# EAGLE design MS_Gauge (EAGLE 7.1.0)
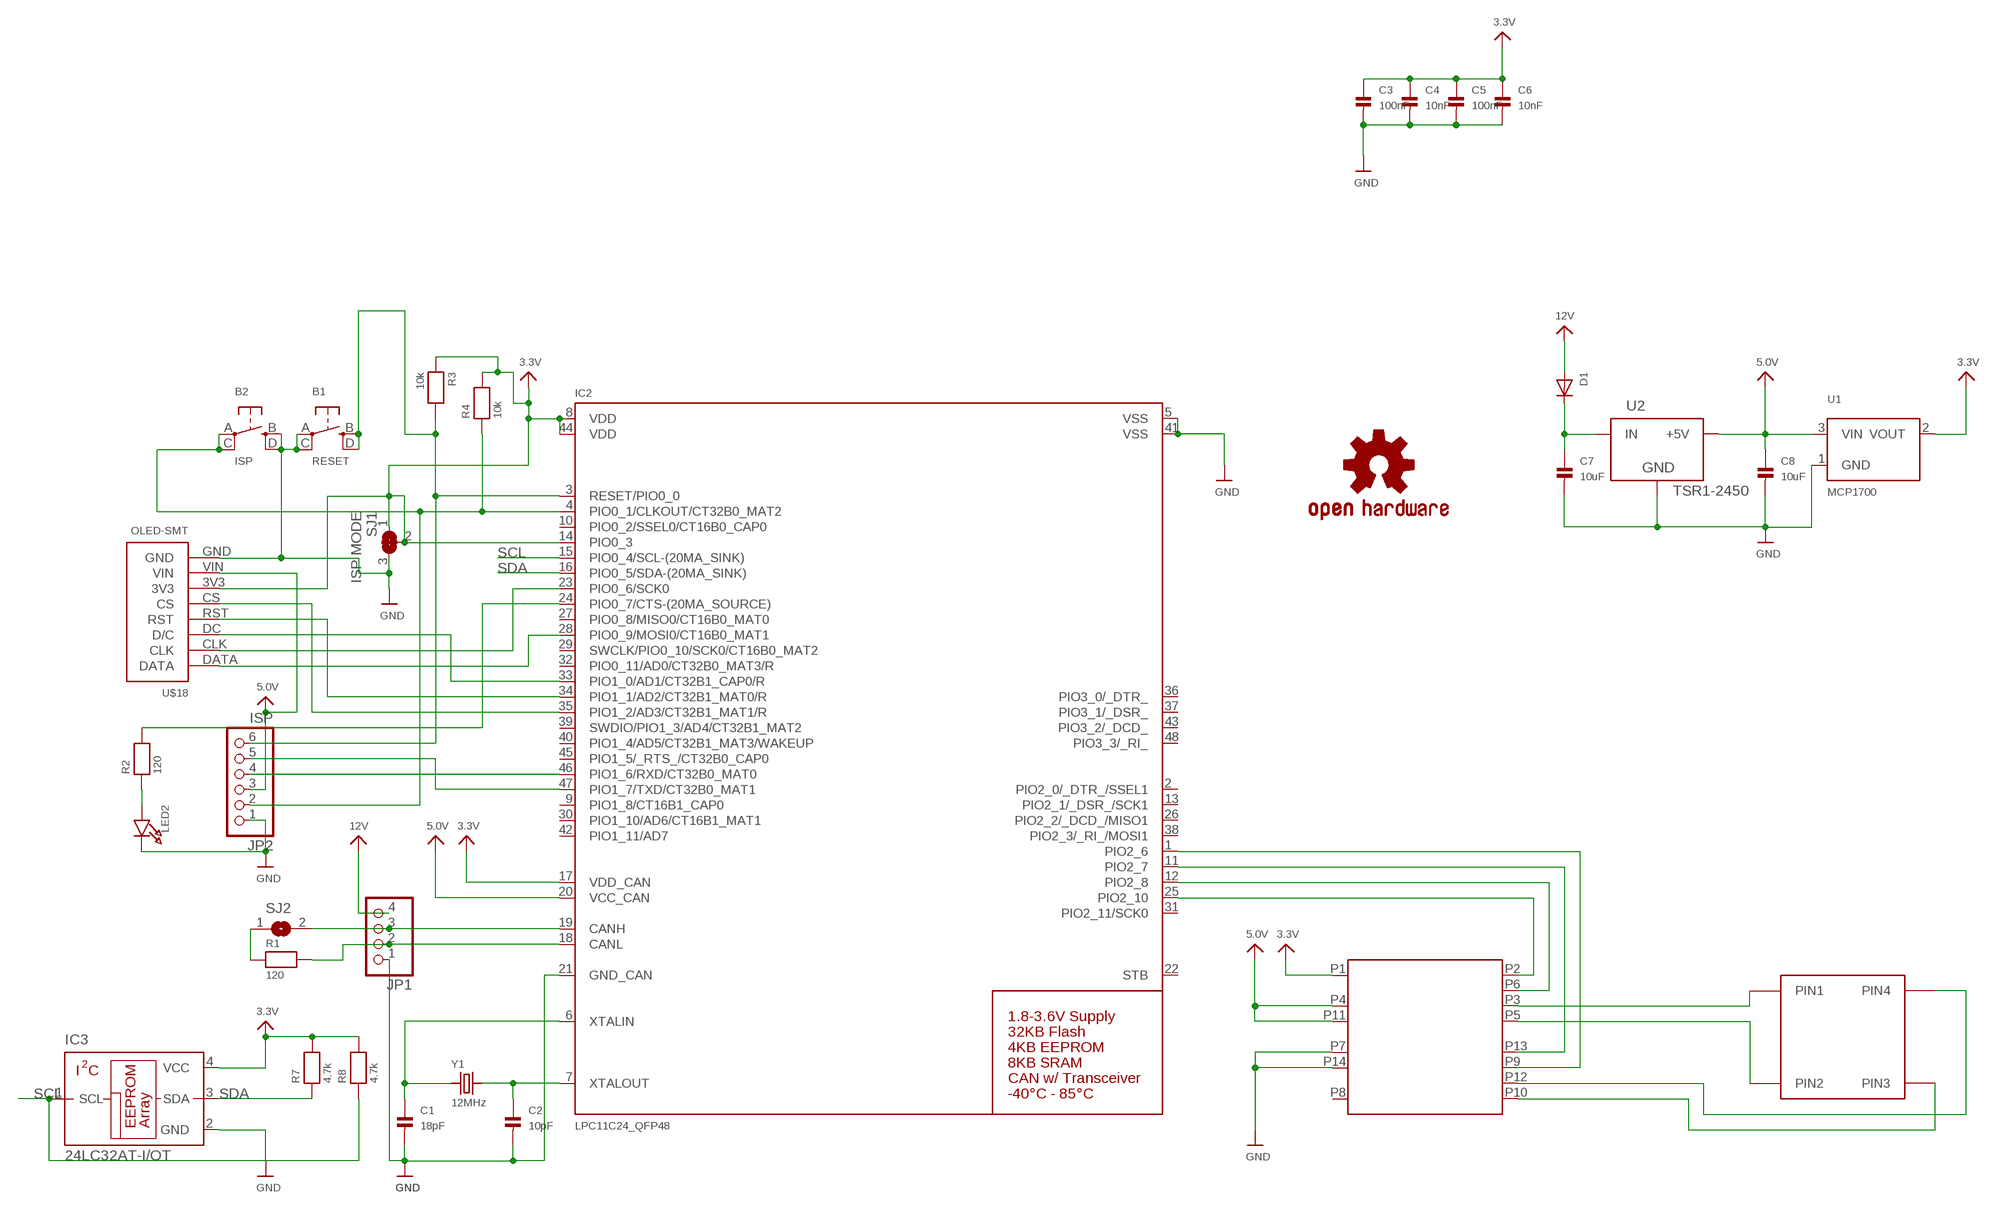
[diagram p0: schematic, sheet 1]

## Parts
B1  RESET  SWITCH_TACT_SMTEVQPQ  [BTN_EVQPQ_4.5MM]
B2  ISP  SWITCH_TACT_SMTEVQPQ  [BTN_EVQPQ_4.5MM]
C1  18pF  CAP_CERAMIC0603  [0603]
C2  10pF  CAP_CERAMIC0603  [0603]
C3  100nF  CAP_CERAMIC0603  [0603]
C4  10nF  CAP_CERAMIC0603  [0603]
C5  100nF  CAP_CERAMIC0603  [0603]
C6  10nF  CAP_CERAMIC0603  [0603]
C7  10uF  CAP_CERAMIC1206  [1206]
C8  10uF  CAP_CERAMIC1206  [1206]
D1  DIODESMA  [SMADIODE]
IC1  B1836M  [MFP14S]
IC2  LPC11C24_QFP48  [LQFP48]
IC3  24LC32AT-I/OT  [SOT23-5L]
JP1  HEADER-1X4ROUND  [1X04_ROUND]
JP2  ISP  HEADER-1X6SMT  [1X06_SMT]
LED2  LED0603  [CHIPLED_0603]
LOGO1  OSHW-LOGOL  [OSHW-LOGO-L]
R1  120  RESISTOR0603  [0603]
R2  120  RESISTOR0603  [0603]
R3  10k  RESISTOR0603  [0603]
R4  10k  RESISTOR0603  [0603]
R7  4.7k  RESISTOR0603  [0603]
R8  4.7k  RESISTOR0603  [0603]
SJ1  ISP MODE  SOLDERJUMPER_2WAY0805  [SOLDERJUMPER_2WAY_OPEN_0805]
SJ2  SOLDERJUMPER  [SOLDERJUMPER_ARROW_NOPASTE]
U1  MCP1700  [SOT23-R]
U2  TSR1-2450  [TSR-1]
U$1  VID29-FLIPPED  [VID29-FLIPPED]
U$18  OLED-SMT  [OLED-1.3-SMT]
Y1  12MHz  CRYSTALTHIN  [CRYSTAL_3.2X2.5]

## Nets
3.3V: C3.1 C4.1 C5.1 C6.1 IC1.P1(VCC) IC2.8(VDD) IC2.14(PIO0_3) IC2.17(VDD_CAN) IC2.44(VDD) IC3.4(VCC) R3.1 R4.2 R7.2 R8.2 SJ1.1 SJ1.2 U1.2(VOUT) U$18.3V3
5.0V: C8.1 IC1.P4(VS1) IC1.P11(VS2) IC2.20(VCC_CAN) JP2.3 U1.3(VIN) U2.3(+5V) U$18.VIN
12V: D1.A JP1.4
GND: B1.A(P) B1.C(P1) B2.B(S) B2.D(S1) C1.2 C2.2 C3.2 C4.2 C5.2 C6.2 C7.2 C8.2 IC1.P7(GND1) IC1.P14(GND2) IC2.5(VSS) IC2.21(GND_CAN) IC2.41(VSS) IC3.2(GND) JP1.1 JP2.1 LED2.C SJ1.3 U1.1(GND) U2.2(GND) U$18.GND
N$1: R1.1 SJ2.1
N$2: IC2.18(CANL) JP1.2 R1.2
N$3: C2.1 IC2.7(XTALOUT) Y1.2
N$4: C1.1 IC2.6(XTALIN) Y1.1
N$6: B2.A(P) B2.C(P1) IC2.4(PIO0_1/CLKOUT/CT32B0_MAT2) JP2.2 R4.1
N$7: IC1.P2(IN1) IC2.25(PIO2_10)
N$8: B1.B(S) B1.D(S1) IC2.3(RESET/PIO0_0) JP2.6 R3.2
N$9: IC1.P13(IN3) IC2.11(PIO2_7)
N$10: IC1.P9(IN4) IC2.1(PIO2_6)
N$11: IC1.P3(OUT1) U$1.PIN1
N$12: C7.1 D1.C U2.1(IN)
N$14: IC1.P5(OUT2) U$1.PIN2
N$15: IC1.P12(OUT3) U$1.PIN4
N$16: IC1.P10(OUT4) U$1.PIN3
N$17: IC2.19(CANH) JP1.3 SJ2.2
N$18: IC2.46(PIO1_6/RXD/CT32B0_MAT0) JP2.4
N$19: IC2.47(PIO1_7/TXD/CT32B0_MAT1) JP2.5
N$20: IC2.28(PIO0_9/MOSI0/CT16B0_MAT1) U$18.DATA
N$21: IC2.33(PIO1_0/AD1/CT32B1_CAP0/R) U$18.DC(D/C)
N$22: IC2.34(PIO1_1/AD2/CT32B1_MAT0/R) U$18.RST
N$23: IC2.23(PIO0_6/SCK0) U$18.CLK
N$24: IC2.35(PIO1_2/AD3/CT32B1_MAT1/R) U$18.CS
N$25: IC2.24(PIO0_7/CTS-(20MA_SOURCE)) R2.2
N$26: LED2.A R2.1
N$27: IC1.P6(IN2) IC2.12(PIO2_8)
SCL: IC2.15(PIO0_4/SCL-(20MA_SINK)) IC3.1(SCL) R8.1
SDA: IC2.16(PIO0_5/SDA-(20MA_SINK)) IC3.3(SDA) R7.1
Unconnected: IC1.P8(VCONT) IC2.2(PIO2_0/_DTR_/SSEL1) IC2.9(PIO1_8/CT16B1_CAP0) IC2.10(PIO0_2/SSEL0/CT16B0_CAP0) IC2.13(PIO2_1/_DSR_/SCK1) IC2.22(STB) IC2.26(PIO2_2/_DCD_/MISO1) IC2.27(PIO0_8/MISO0/CT16B0_MAT0) IC2.29(SWCLK/PIO0_10/SCK0/CT16B0_MAT2) IC2.30(PIO1_10/AD6/CT16B1_MAT1) IC2.31(PIO2_11/SCK0) IC2.32(PIO0_11/AD0/CT32B0_MAT3/R) IC2.36(PIO3_0/_DTR_) IC2.37(PIO3_1/_DSR_) IC2.38(PIO2_3/_RI_/MOSI1) IC2.39(SWDIO/PIO1_3/AD4/CT32B1_MAT2) IC2.40(PIO1_4/AD5/CT32B1_MAT3/WAKEUP) IC2.42(PIO1_11/AD7) IC2.43(PIO3_2/_DCD_) IC2.45(PIO1_5/_RTS_/CT32B0_CAP0) IC2.48(PIO3_3/_RI_)

## Library data of the parts
B1 B2 = microbuilder:SWITCH_TACT_SMT: SMT Tact Switches 6x6mm - Digikey: P12940SCT-ND KMR2 (4.6x2.8mm) - Digikey: 401-1426-1-ND EVQ-PQHB55 - Light Touch, 160GF (4.5x4.5mm) - Digikey: P8090SCT-ND
C1-C8 = microbuilder:CAP_CERAMIC: Ceramic Capacitors 0402 - 0402 Surface Mount Capacitors 16pF 50V 5% [Digikey: 445-4899-2-ND] 18pF 50V 5% [Digikey: 490-1281-2-ND] 22pF 50V 5% [Digikey: 490-1283-2-ND] 68pF 50V 5% [Digikey: 490-1289-2-ND] 0.1uF 10V 10% [Digikey: 490-1318-2-ND] 1.0uF 6.3V 10% [Digikey: 490-1320-2-ND] 0603 - 0603 Surface Mount Capacitors 16 pF 50V 5% [Digikey: 445-5051-2-ND] 22 pF 50V [Digikey: PCC220ACVTR-ND] 33 pF 50V 5% [Digikey: 490-1415-1-ND] 56pF 50V 5% [Digikey: 490-1421-1-ND] 220pF 50V 5% [Digikey: 445-1285-1-ND] 680 pF 50V 2200 pF 50V 5% C0G [Digikey: 445-1297-1-ND] 5600 pF 100V 5% X7R [Digikey: 478-3711-1-ND] 0.1 µF 25V 10% [Digikey: PCC2277TR-ND] 0.22 µF 16V 10% X7R [Digikey: 445-1318-1-ND] 1.0 µF 25V 10% [Digikey: 445-5146-2-ND] 0603 - RF Specific 3pF 250V +/-0.1pF RF [Digikey: 712-1347-1-ND] 18 pF 250V 5% [Digikey: 478-3505-1-ND or 712-1322-1-ND] 56 pF 250V 5% C0G RF [Digikey: 490-4867-1-ND] 68 pF 250V RF [Digikey: 490-4868-1-ND] 0805 - 0805 Surface Mount Capacitors 220 pF 250V 2% RF Ceramic Capacitor [Digikey: 712-1398-1-ND] 1000 pF 50V 2% NP0 Ceramic Capacitor [Digikey: 478-3760-1-ND] 0.1 µF 25V 10% Ceramic Capacitor [Digikey: PCC1828TR-ND] 1.0 µF 16V 10% Ceramic Capacitor[Digikey: 490-1691-2-ND] 10.0 µF 10V 10% Ceramic Capacitor[Digikey: 709-1228-1-ND] 10.0 uF 16V 10% Ceramic Capacitor [Digikey: 478-5165-2-ND] 47 uF 6.3V 20% Ceramic Capacitor [Digikey: 587-1779-1-ND or 399-5506-1-ND] 1206 - 1206 Surface Mount Capacitors 47uF 10V 20% Ceramic Capacitor [Digikey: 490-5528-1-ND or 399-5508-1-ND or 445-6010-1-ND] 100uF 6.3V -20%, +80% Y5V Ceramic Capacitor (Digikey: 490-4512-1-ND, Mouser: 81-GRM31CF50J107ZE1L)
D1 = microbuilder:DIODE: Diode SMA Model Volts Amps Type Vf Vr Digikey # Notes SSA34-E3 40V 3A Schottky 480mV @ 3A 200uA @ 40V SSA34-E3/61TGITR-ND CDBA120-G 20V 1A Schottky 500mV @ 1A 500uA @ 20V 641-1014-6-ND REEL MBRA210 10V 2A Schottky 350mV @ 2A 700uA @ 10V MBRA210LT3 SOD-123 Model Volts Amps Type Vf Vr Order # Notes BAT54T1G 30V 200mA Schottky 800mV @ 200mA 2uA @ 25V BAT54T1GOSTR-ND B0530W 30V 500mA Schottky 430mV @ 500mA 130uA @ 30V B0530W-FDICT-ND REEL MBR120 1A 20V Schottky 340mV @ 1A MBR120VLSFT1GOSCT-ND SOD-323 Model Volts Amps Type Vf Vr Order # Notes PMEG2005EJ 20V 500mA Schottky 355mV @ 500mA 568-4110-1-ND ZLLS410 10V 570mA Schottky 380mV @ 570mA ZLLS410CT-ND 1N4148WS 75V 150mA Silicon/Simple 1V 1N4148WSFSCT-ND REEL SOD-523 Model Volts Amps Type Vf Vr Order # Notes BAT54XV2 30V 200mA Schottky 0.8V @ 100mA BAT54XV2CT-ND TB751S 30V 30mA Schottky RB751S-40TE61CT-ND SOT23-R/W (R = Solder Paste/Reflow Ovens, W = Hand-Soldering) Model Volts Amps Type Vf Vr Order # Notes BAT54FILM 40V 300mA Schottky 497-7162-1-ND
IC1 = LeoBuild:B1836M
IC2 = microbuilder:LPC11C24_QFP48
IC3 = microchip:24LC32AT-I/OT
JP1 = microbuilder:HEADER-1X4: PIN HEADER
JP2 = microbuilder:HEADER-1X6: PIN HEADER
LED2 = microbuilder:LED: LED 0603 - 0603 Surface Mount Package 2mA: Green LED - Low Power (3.9mcd, 2ma, 1.7Vf) - Digikey: 475-2709-2-ND Orange LED - Low Power (9.8mcd, 2ma, 1.8Vf) - Digikey: 475-1194-2-ND Red LED - Low Power (5mcd, 2ma, 1.8Vf) - Digikey: 475-1195-2-ND Yellow LED - Low Power (7mcd, 2ma, 1.8Vf) - Digikey: 475-1196-2-ND 5mA: Blue LED - Low Power (17mcd, 5ma, 2.9Vf) - Digikey: LNJ937W8CRACT-ND 0805 - 0805 Surface Mount Package 2mA: Red LED (8.8mcd, 2mA, 1.8Vf, Clear) - Low Power [Digikey: 475-2510-1-ND] Green LED (5mcd, 2mA, 1.8Vf, Clear) - Low Power [Digikey: 475-2730-1-ND] Yellow LED (11.3mcd, 2mA, 1.8Vf, Clear) - Low Power [Digikey: 475-2555-1-ND] 20mA: Red LED (104mcd, 20mA, Diffused) - LS R976 [Digikey: 475-1278-6-ND] Red LED (12mcd, 20mA, 2.0Vf, Clear) - APT2012EC [Digikey: 754-1128-1-ND] Green LED (15mcd, 20mA, 2.2Vf, Clear) - APT2012GC [Digikey: 754-1131-1-ND] Orange LED (160mcd, 20mA, 2.1Vf, Clear) - APT2012SECK [Digikey: 754-1130-1-ND] 1206 - 1206 Surface Mount Package Green LED (26mcd, 20mA, Diffused) - LG N971 [Digikey: 475-1407-6-ND] Red LED (15mcd, 20mA, Diffused) - LH N974 [Digikey: 475-1416-6-ND]
LOGO1 = SparkFun-Aesthetics:OSHW-LOGO: Open Source Hardware Logo This logo indicates the piece of hardware it is found on incorporates a OSHW license and/or adheres to the definition of open source hardware found here: http://freedomdefined.org/OSHW
R1-R4 R7 R8 = microbuilder:RESISTOR: Resistors 0402 - 0402 Surface Mount Package 22 Ohm 1% 1/16W [Digikey: 311-22.0LRTR-ND] 33 Ohm 5% 1/16W 1.0K 5% 1/16W 1.5K 5% 1/16W 2.0K 1% 1/16W 10.0K 1% 1/16W [Digikey: 311-10.0KLRTR-ND] 10.0K 5% 1/16W [Digikey: RMCF0402JT10K0TR-ND] 12.1K 1% 1/16W [Digikey: 311-22.0LRTR-ND] 100.0K 5% 1/16W 0603 - 0603 Surface Mount Package 0 Ohm 1/10 Watt 1% Resistor 15 Ohm 1/10 Watt 1% Resistor 33 Ohm 1/10 Watt 1% Resistor 49.9 Ohm 1/10 Watt 1% Resistor 100 Ohm 1/10 Watt 1% Resistor 150 Ohm 1/10 Watt 1% Resistor 240 Ohm 1/10 Watt 1% Resistor 390 Ohm 1/10 Watt 1% Resistor 560 Ohm 1/10 Watt 1% Resistor 680 Ohm 1/10 Watt 1% Resistor 750 Ohm 1/10 Watt 1% Resistor 1.0K Ohm 1/10 Watt 1% Resistor 1.5K Ohm 1/10 Watt 1% Resistor 2.0K Ohm 1/10 Watt 1% Resistor 2.2K Ohm 1/10 Watt 1% Resistor 3.3K Ohm 1/10 Watt 1% Resistor 4.7K Ohm 1/10 Watt 1% Resistor 10.0K Ohm 1/10 Watt 1% Resistor 12.0K Ohm 1/10 Watt 1% Resistor 12.1K Ohm 1/10 Watt 1% Resistor 20.0K Ohm 1/10 Watt 1% Resistor 33.0K Ohm 1/10 Watt 1% Resistor 100.0K Ohm 1/10 Watt 1% Resistor 0805 - 0805 Surface Mount Package 0 Ohm 1/8 Watt 1% Resistor 33 Ohm 1/8 Watt 1% Resistor 100 Ohm 1/8 Watt 1% Resistor 150 Ohm 1/8 Watt 1% Resistor 200 Ohm 1/8 Watt 1% Resistor 240 Ohm 1/8 Watt 1% Resistor 330 Ohm 1/8 Watt 1% Resistor 390 Ohm 1/8 Watt 1% Resistor 470 Ohm 1/8 Watt 1% Resistor 1.0K Ohm 1/8 Watt 1% Resistor 1.5K Ohm 1/8 Watt 1% Resistor 2.0K Ohm 1/8 Watt 1% Resistor 4.7K Ohm 1/8 Watt 1% Resistor 5.1K Ohm 1/8 Watt 1% Resistor 5.6K Ohm 1/8 Watt 1% Resistor 10.0K Ohm 1/8 Watt 1% Resistor 22.0K Ohm 1/8 Watt 1% Resistor 33.0K Ohm 1/8 Watt 1% Resistor 100K Ohm 1/8 Watt 1% Resistor 1206 - 1206 Surface Mount Package 2012 - 2010 Surface Mount Package 0.11 Ohm 1/2 Watt 1% Resistor - Digikey: RHM.11UCT-ND
SJ1 = microbuilder:SOLDERJUMPER_2WAY: 2-Way Solder Jumper
SJ2 = microbuilder:SOLDERJUMPER: SMD Solder JUMPER Solder the two pads together to create a connection, or remove the solder to break it. REFLOW - Use this footprint for solder paste and reflow ovens. WAVE - Use this footprint for hand-soldering (larger pads). CLOSED - Has a trace between the two pads to ensure it is closed by default. The trace needs to be cut to disable the jumper, and can be closed again by creating a solder bridge between the two pads.; BOM: EXCLUDE
U1 = microbuilder:MCP1700
U2 = SteelCaveRobotics-Power:TSR1-2450: Traco Power TSR 1-2450 5.0v switching regulator
U$1 = Evans:VID29-FLIPPED
U$18 = custom:OLED-SMT
Y1 = microbuilder:CRYSTAL: Crystals HC49UP - Surface Mount Crystal 4.0MHz 18pF +/-30ppm Surface Mount Crystal [Digikey: 535-9857-1-ND] 12.0 MHz Surface Mount Crystal [Digikey: 535-9869-6-ND] 25.0 MHz Surface Mount Crystal [Digikey: 535-9078-1-ND] 2.5 x 2.0mm - MEMs SMT Crystal 16.0 MHz 10pF 20ppm 2.5 x 2.0mm Crystal [Digikey -40-85°C: 535-10923-1-ND] 3.2 x 2.5mm - MEMs SMT Crystal 12.0 MHz 8pF 15ppm 3.2 x 2.5mm Crystal [Digikey: -10-70°C: 644-1047-1-ND -40-125°C: 644-1128-1-ND] 16.0 MHz 8pF 15ppm 3.2 x 2.5mm Crystal [Digikey: -10-70°C: 644-1049-1-ND -40-125°C: 644-1129-2-ND] 16.0 MHz 10pF 10ppm 3.2 x 2.5mm Crystal [Digikey: 644-1100-1-ND] 27.12 MHz 18pF 30ppm 3.2 x 2.5mm Crystal [Digikey: 887-1424-1-ND] 27.12MHz 10pF 10ppm 3.2 x 2.5mm Crystal [Digikey: 887-1329-1-ND] 4.9 x 1.8mm - MEMs SMT Crystal 32.768 KHz 12.5pF 20ppm 4.9 x 1.8mm Crystal [Digikey: SE2415CT-ND] 8.0 x 3.8mm - Surface Mount Crystal 32.768kHz 12.5pF 20ppm -40°C-85°C [Digikey: 535-9166-2-ND] Cylinder 32.768KHz Cylinder Crystal (2x6mm body) [Ex. Digikey: 300-8341-2-ND]

## Net classes
0 default: clearance 0.205 mm

## Board
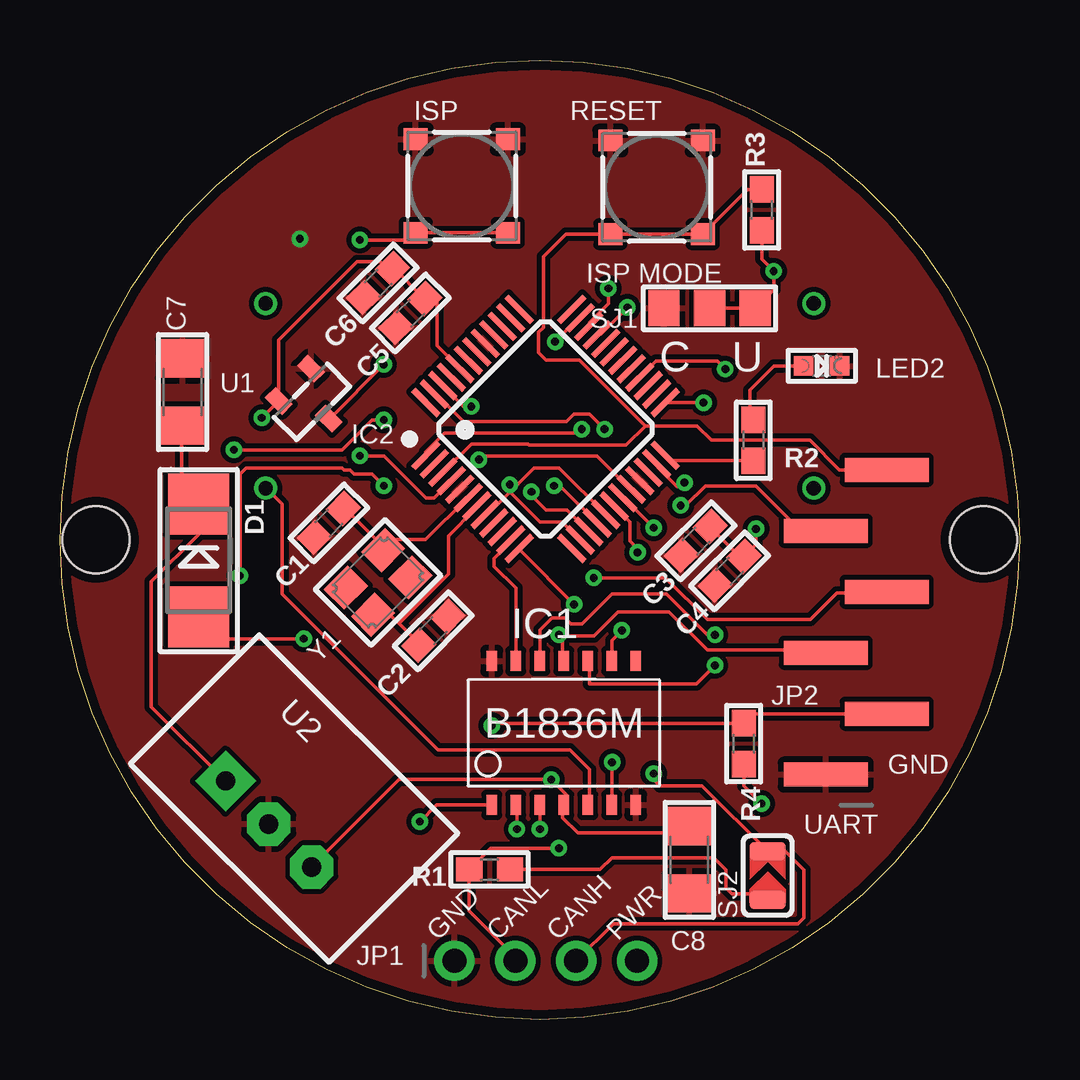
[diagram p1: board, top side]
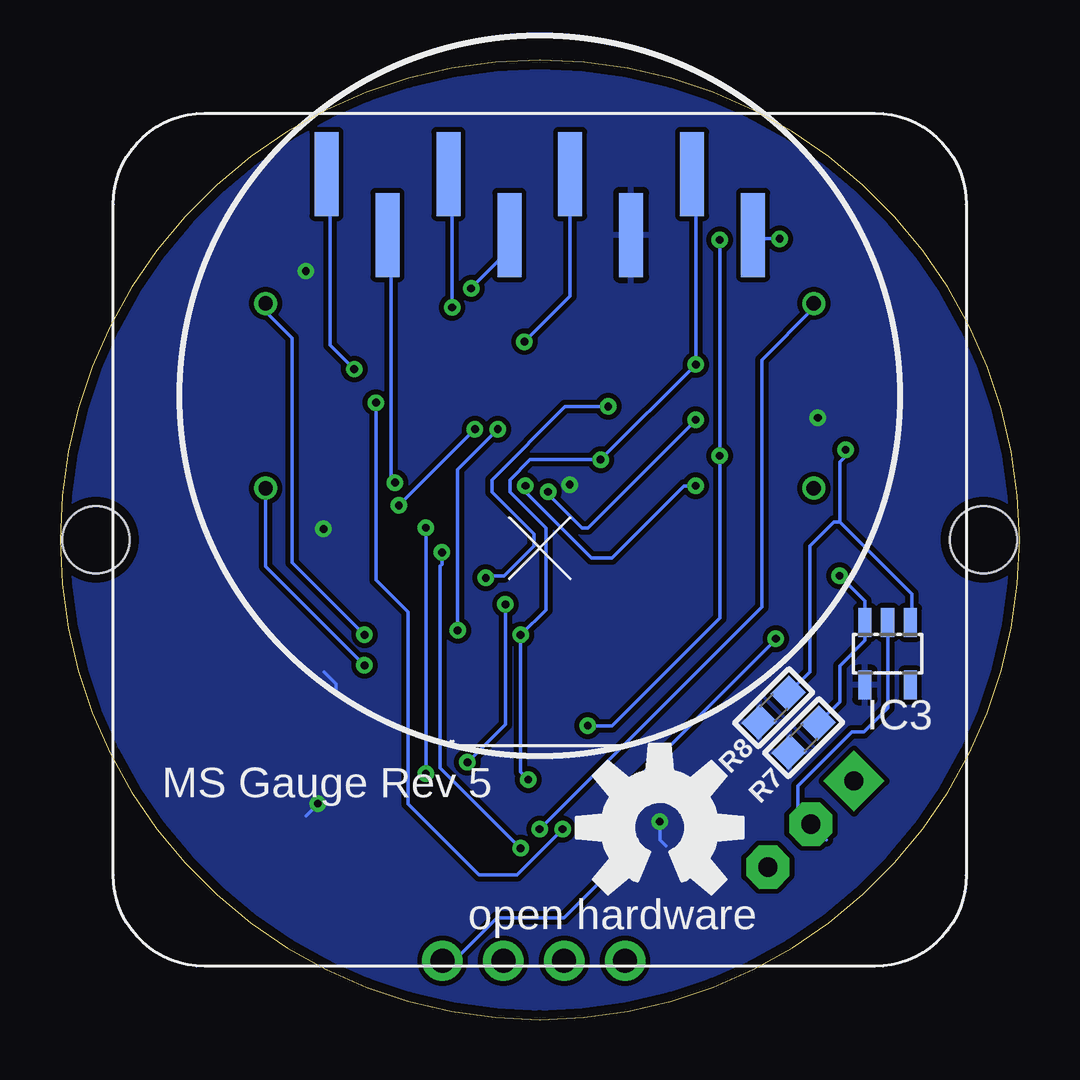
[diagram p2: board, bottom side, seen from below]

Size 40 x 40 mm. Coordinates in mm from the lower left corner, seen from the top.
Outline: 0,20 arc-90 20,40 arc-90 40,20 arc-90 20,0 arc-90 0,20
Copper layers (1*16): Top 0.0356mm / dielectric 1.5011mm / Bottom 0.0356mm
Design rules "oshpark-2layer": minimum track width 6mil, minimum drill 13mil, track to track 6mil, track to pad 6mil, pad to pad 6mil, via to via 6mil, smd to smd 6mil, copper to edge 15mil, drill to drill 6mil, minimum pad ring 7mil, minimum via ring 7mil, stop-mask expansion 4mil, vias tented up to drill 0mil, thermal gap 10mil
Holes 2.8 mm at 1.5,20 38.5,20

### Footprints (pad centres in the part's own frame; a part is rotated, then mirrored left to right if it is on the bottom)
BTN_EVQPQ_4.5MM = smd 0.9 x 1: A -1.95,1.925; B 1.95,1.925; C -1.95,-1.925; D 1.95,-1.925
0603 = smd 1.1 x 1: 1 -0.85,0; 2 0.85,0
1206 = smd 1.6 x 1.8: 1 -1.4,0; 2 1.4,0
SMADIODE = smd 2.54 x 2.54: A 2.349,0; C -2.349,0
MFP14S = smd 0.45 x 0.85: P1 1,-0.8; P2 2,-0.8; P3 3,-0.8; P4 4,-0.8; P5 5,-0.8; P6 6,-0.8; P7 7,-0.8; P8 7,5.2; P9 6,5.2; P10 5,5.2; P11 4,5.2; P12 3,5.2; P13 2,5.2; P14 1,5.2
LQFP48 = smd 1.5 x 0.25: 1 -4.3,2.75; 2 -4.3,2.25; 3 -4.3,1.75; 4 -4.3,1.25; 5 -4.3,0.75; 6 -4.3,0.25; 7 -4.3,-0.25; 8 -4.3,-0.75; 9 -4.3,-1.25; 10 -4.3,-1.75; 11 -4.3,-2.25; 12 -4.3,-2.75; 25 4.3,-2.75; 26 4.3,-2.25; 27 4.3,-1.75; 28 4.3,-1.25; 29 4.3,-0.75; 30 4.3,-0.25; 31 4.3,0.25; 32 4.3,0.75; 33 4.3,1.25; 34 4.3,1.75; 35 4.3,2.25; 36 4.3,2.75 | smd 0.25 x 1.5: 13 -2.75,-4.3; 14 -2.25,-4.3; 15 -1.75,-4.3; 16 -1.25,-4.3; 17 -0.75,-4.3; 18 -0.25,-4.3; 19 0.25,-4.3; 20 0.75,-4.3; 21 1.25,-4.3; 22 1.75,-4.3; 23 2.25,-4.3; 24 2.75,-4.3; 37 2.75,4.3; 38 2.25,4.3; 39 1.75,4.3; 40 1.25,4.3; 41 0.75,4.3; 42 0.25,4.3; 43 -0.25,4.3; 44 -0.75,4.3; 45 -1.25,4.3; 46 -1.75,4.3; 47 -2.25,4.3; 48 -2.75,4.3
SOT23-5L = smd 0.55 x 1.2: 1 -0.95,-1.3; 2 0,-1.3; 3 0.95,-1.3; 4 0.95,1.3; 5 -0.95,1.3
1X04_ROUND = drill 1 pad 1.676: 1 -3.81,0; 2 -1.27,0; 3 1.27,0; 4 3.81,0
1X06_SMT = smd 1 x 3.5: 1 -6.35,1.27; 2 -3.81,-1.27; 3 -1.27,1.27; 4 1.27,-1.27; 5 3.81,1.27; 6 6.35,-1.27
CHIPLED_0603 = smd 0.8 x 0.8: A 0,-0.75; C 0,0.75
SOLDERJUMPER_2WAY_OPEN_0805 = smd 1.3 x 1.5: 1 -1.9,0; 2 0,0; 3 1.9,0
SOLDERJUMPER_ARROW_NOPASTE = smd 0.762 x 1.524: 1 -1.016,0; 2 1.016,0
SOT23-R = smd 0.635 x 1.016: 1 -0.95,-1; 2 0.95,-1; 3 0,1
TSR-1 = drill 0.8 pad 1.8 square: 1 -2.54,-1.5 | drill 0.8 pad 1.8 octagon: 2 0,-1.5; 3 2.54,-1.5
VID29-FLIPPED = drill 0.6: PIN1 -11.425,-3.85; PIN2 -11.425,3.85; PIN3 11.425,3.85; PIN4 11.425,-3.85
OLED-1.3-SMT = smd 1 x 3.5: 3V3 3.81,12.7; CLK -6.35,12.7; CS 1.27,15.24; DATA -8.89,15.24; DC -3.81,15.24; GND 8.89,12.7; RST -1.27,12.7; VIN 6.35,15.24
CRYSTAL_3.2X2.5 = smd 1.4 x 1.2: 1 -1.1,-0.8; 2 1.1,0.8; GND1 -1.1,0.8; GND2 1.1,-0.8

### Placement (x,y rotation side)
B1  24.87,34.69 270 top
B2  16.75,34.75 90 top
C1  11.21,20.7 225 top
C2  15.56,16.2 45 top
C3  26.51,19.95 225 top
C4  27.91,18.7 225 top
C5  14.61,29.45 225 top
C6  13.26,30.7 225 top
C7  5.11,26.16 90 top
C8  26.23,6.66 270 top
D1  5.78,19.14 270 top
IC1  17,9.75 0 top
IC2  20.24,24.62 45 top
IC3  5.5,15.25 180 bottom
JP1  20.25,2.45 0 top
JP2  33.19,16.56 90 top
LED2  31.75,27.25 270 top
LOGO1  15,8 0 bottom
R1  17.91,6.26 180 top
R2  28.9,24.15 270 top
R3  29.25,33.75 90 top
R4  28.5,11.5 270 top
R7  9,11.75 225 bottom
R8  10.25,13 225 bottom
SJ1  27.08,29.65 180 top
SJ2  29.5,6 90 top
U1  10.5,25.75 225 top
U2  9.76,9.21 315 top
U$1  20,26 180 bottom
U$18  20,20 0 bottom
Y1  13.26,18.22 225 top

### Tracks (layer width: path | path; a pad name or v marks a point on that pad's centre or on a via)
3.3V  (via drill 0.33)
  Top 0.152: 21.91,21.91 22.7,21.11 IC2.17 20.8,23 19.75,23 18.75,22 | C3.1 27.15,20.48 28.26,19.37 28.42,19.37 C4.1 | v8.41,25.08 9.05,25.72 U1.2 | 9.21,25.88 U1.2 | IC2.44 16.67,27.15 15.72,28.1 15.72,30 15.24,30 C5.1 15.08,30.16 13.97,31.27 C6.1 13.81,31.43 13.49,31.43 13.34,31.59 12.38,31.59 9.12,28.33 U1.2 | 28.57,19.37 C4.1 | SJ1.2 SJ1.1 29.75,30.42 v29.75,31.2 29.25,31.7 R3.1 | IC2.14 20.93,20.75 20,20.75 18.75,22 | R4.2 28.5,9.75 v29.25,9 | IC1.P1 15.7,8.95 v15,8.25 | v29.02,20.45 29.02,19.81 C4.1 | 18.75,22 17.8,21.05 IC2.8 | 18.75,22 v18.75,22.3
  Bottom 0.152: 28.5,13.75 28.5,14 29,14.5 | v29.25,9 29.75,8.5 | v15,8.25 15,7.5 14.75,7.25
  pour Bottom: 0,20 arc-90 20,40 arc-90 40,20 arc-90 20,0 arc-90
5.0V  (via drill 0.33)
  Top 0.152: C8.1 26.83,8.26 26.35,7.78 21.59,7.78 20.95,8.41 20.95,8.89 IC1.P4 21.11,9.05 21.11,9.37 v20.48,10 14.13,10 10.64,6.51 U2.3 | 20.95,16.03 20.95,15.08 IC1.P11 | JP2.3 31.91,15.4 26.99,15.4 25.39,17 23.25,17 22.25,16 21,16 20.97,16.03 20.95,16.03 | v13.49,27.3 11.27,25.08 U1.3 | IC2.20 23.65,22.23 22.38,23.5 17.5,23.5 17.46,23.46 v17.46,23.34 | v20.8,16.03 20.95,16.03
  Bottom 0.152: U$18.VIN 13.49,35.08 v13.49,27.3 v17.46,23.34 20.41,23.34 21.25,22.5 21.25,22 19.75,20.5 19.75,17.08 v20.8,16.03 20.8,10.32 v20.48,10
12V  (via drill 0.33)
  Top 0.152: v10.16,15.88 6.67,15.88 5.87,16.67 D1.A
  Bottom 0.152: JP1.4 23.97,2.54 23.5,2.54 21.79,4.25 19,4.25 16.75,6.5 16.75,9.25 10.16,15.84 v10.16,15.88
GND  (via drill 0.33)
  Bottom 0.152: v10,32.54 10.95,32.54 U$18.GND | 8.05,7.5 U2.2 | U2.2 8.75,8.2 | IC3.2 5.5,13 6.5,12 7,12 9.25,9.75 9.25,8.75 8.7,8.2 U2.2
  pour Top: 0,20 arc-90 20,40 arc-90 40,20 arc-90 20,0 arc-90
N$1
  Top 0.152: R1.1 22.51,6.26 23,6.75 27.25,6.75 27.75,6.25 27.75,5.5 28,5.25 29.23,5.25 SJ2.1
N$2  (via drill 0.33)
  Top 0.152: JP1.2 19.05,2.54 17.06,4.53 R1.2 17.94,7.14 v20.8,7.14 | 23.18,21.27 IC2.18 23.75,20.75 23.75,19.95 24.08,19.62 v24.08,19.47
  Bottom 0.152: v20.8,7.14 24.15,10.5 24.15,18.9 24.08,18.97 v24.08,19.47
N$3
  Top 0.152: 14.13,16.51 13.81,16.83 13.18,16.83 Y1.2 | 14.13,16.51 14.92,15.72 C2.1 | 14.13,16.51 16.19,18.57 16.19,20.16 17.3,21.27 IC2.7
N$4
  Top 0.152: 13.18,20 13.49,19.68 Y1.1 13.18,20 | 13.18,20 11.91,21.27 C1.1 | 13.18,20 15.24,20 16.99,21.75 IC2.6
N$6  (via drill 0.33)
  Top 0.152: 12.5,23.25 v12.5,23.5 13.5,23.5 15.25,21.75 15.6,21.75 IC2.4 | JP2.2 28.9,12.75 R4.1 18.1,12.35 v18,12.25 | B2.C B2.A 14.53,32.5 v12.5,32.5
  Bottom 0.152: v12.5,32.5 v12.5,23.5 12.5,16.75 17,12.25 v18,12.25
N$7  (via drill 0.33)
  Top 0.152: v19.05,7.94 19.05,8.89 IC1.P2 | v26.83,25.72 IC2.25
  Bottom 0.152: v19.05,7.94 20.95,6.03 22.53,6.03 25.5,9 25.5,17 26.83,18.33 v26.83,25.72
N$8
  Top 0.152: B1.B B1.D 21.16,32.74 | R3.2 28.66,34.6 B1.B | JP2.6 32.49,22.91 31.25,24.15 27.15,24.15 26.55,24.75 24.4,24.75 | 24.4,24.75 23.6,23.95 19.55,23.95 19.5,24 17.15,24 IC2.3 | B1.B 21.09,32.74 20.15,31.8 20.15,28.85 19.95,28.65 19.95,27.8 20.25,27.5 21.65,27.5 24.4,24.75
N$9
  Top 0.152: 19.05,15.08 IC1.P13 19,17.99 18.1,18.89 18.1,19.21 18.73,19.84 IC2.11
N$10  (via drill 0.33)
  Top 0.152: v21.75,24.61 21.59,24.45 16.03,24.45 15.24,23.65 IC2.1 | 23.02,14.92 IC1.P9 23,15.8 v23.42,16.22
  Bottom 0.152: v23.42,16.22 23.42,22.94 v21.75,24.61
N$11  (via drill 0.33)
  Top 0.152: v20,7.94 20,8.89 IC1.P3
  Bottom 0.152: 8.73,29.84 U$1.PIN1 8.57,29.68 10.75,27.5 10.75,17.19 v20,7.94
N$12
  Top 0.152: 5.08,21.59 5.08,24.61 C7.1 | 5.08,21.59 5.71,21.59 D1.C | 5.08,21.59 D1.C | 6.83,10 U2.1 3.81,13.04 3.81,18.26 5.78,20.23 D1.C
N$14
  Top 0.152: IC1.P5 22.07,9.05 22.07,10.43 21.25,11.25 15.75,11.25 9.25,17.75 9.25,21.5 8.6,22.15 U$1.PIN2 8.57,22.07
N$15  (via drill 0.33)
  Top 0.152: v27.3,16.03 26.99,16.03 25.27,17.75 23,17.75 21.75,16.5 21.3,16.5 21.05,16.75 20.5,16.75 20,16.25 IC1.P12 20,15.08
  Bottom 0.152: v27.3,16.03 30.32,19.05 30.32,28.42 31.27,29.37 31.27,29.84 U$1.PIN4
N$16  (via drill 0.33)
  Top 0.152: IC1.P10 22.07,14.92 22.07,14 26.54,14 v27.3,14.76
  Bottom 0.152: v27.3,14.76 31.43,18.89 31.43,22.07 U$1.PIN3
N$17  (via drill 0.33)
  Top 0.152: v24.75,10.25 24.75,10 25,9.75 26.77,9.75 SJ2.2 30.23,7.02 31,6.25 31,4.25 30.75,4 23.07,4 JP1.3 | v24.75,20.5 23.49,21.76 IC2.19
  Bottom 0.152: v24.75,10.25 v24.75,20.5
N$18  (via drill 0.33)
  Top 0.152: v17.14,25.56 16.83,25.56 16.03,26.35 IC2.46 | JP2.4 34.45,17.78 32.38,17.78 31.27,16.67 26.99,16.67 25.24,18.41 v22.25,18.41
  Bottom 0.152: v22.25,18.41 22.16,18.5 21.5,18.5 20.25,19.75 20.25,20.25 22,22 22,22.5 18.94,25.56 v17.14,25.56
N$19  (via drill 0.33)
  Top 0.152: v22.7,24.61 22.07,25.24 21.43,25.24 21.11,24.92 16.83,24.92 15.72,26.04 IC2.47 | 26.04,21.59 v25.88,21.43 26.08,21.43 26.9,22.25 29,22.25 30.75,20.5 31.79,20.5 JP2.5 31.91,20.48
  Bottom 0.152: v25.88,21.43 v22.7,24.61
N$20  (via drill 0.33)
  Top 0.152: IC2.28 24.29,26.83 24.29,26.89 24.85,27.45 27.4,27.45 v27.73,27.11
  Bottom 0.152: U$18.DATA 28.73,35.08 28.73,28.11 v27.73,27.11
N$21  (via drill 0.33)
  Top 0.152: v23.65,29.69 22.54,28.57 IC2.33
  Bottom 0.152: v23.65,29.69 23.65,35.08 U$18.DC
N$22  (via drill 0.33)
  Top 0.152: v22.86,30.48 22.86,29.84 22.07,29.05 IC2.34
  Bottom 0.152: v22.86,30.48 21.27,32.07 21.27,32.54 U$18.RST
N$23  (via drill 0.33)
  Top 0.152: v26.04,22.38 25.88,22.23 25.72,22.23 24.92,23.02 IC2.23
  Bottom 0.152: v26.04,22.38 26.19,22.54 26.19,32.54 U$18.CLK
N$24  (via drill 0.33)
  Top 0.152: v20.64,28.26 21.59,29.21 IC2.35
  Bottom 0.152: v20.64,28.26 18.73,30.16 18.73,35.08 U$18.CS
N$25
  Top 0.152: IC2.24 25.45,23.3 R2.2
N$26
  Top 0.152: 30.96,27.15 LED2.A 29.75,27.25 28.75,26.25 28.75,25.15 R2.1
N$27  (via drill 0.33)
  Top 0.152: v21.43,17.3 19.21,19.53 IC2.12 | IC1.P6 23.02,9.05 v23.02,10.72
  Bottom 0.152: v21.43,17.3 21.43,12.31 v23.02,10.72
SCL  (via drill 0.33)
  Top 0.152: v13.5,25 13,25 11.75,23.75 v7.25,23.75 | IC2.15 21.14,21.25 20.25,21.25 19.65,21.85 v19.65,22
  Bottom 0.152: v19.65,22 19.65,21.9 18.25,20.5 18,20.5 v13.5,25 | v7.25,23.75 7.25,23.5 7.5,23.25 7.5,20.75 | IC3.1 4.5,16.6 4.5,17.75 7.5,20.75 | R8.1 8.75,14.5 8.75,19.75 7.75,20.75 7.5,20.75
SDA  (via drill 0.33)
  Top 0.152: IC2.16 20.84,22.25 v20.6,22.25 | v7.5,18.5 7.5,22.75 7.75,23 11.75,23 11.85,22.9 12.1,22.9 12.25,22.75 13,22.75 v13.5,22.25
  Bottom 0.152: v13.5,22.25 14,22.25 17,19.25 17.85,19.25 20.6,22 v20.6,22.25 20.6,22.1 | R7.1 7.5,13.25 7.5,14.75 6.45,15.8 IC3.3 6.45,17.45 v7.5,18.5

### Text on the board
tNames: ISP | RESET | C | U | GND | UART | GND | CANL | CANH | PWR
bNames: MS Gauge Rev 5 | open hardware